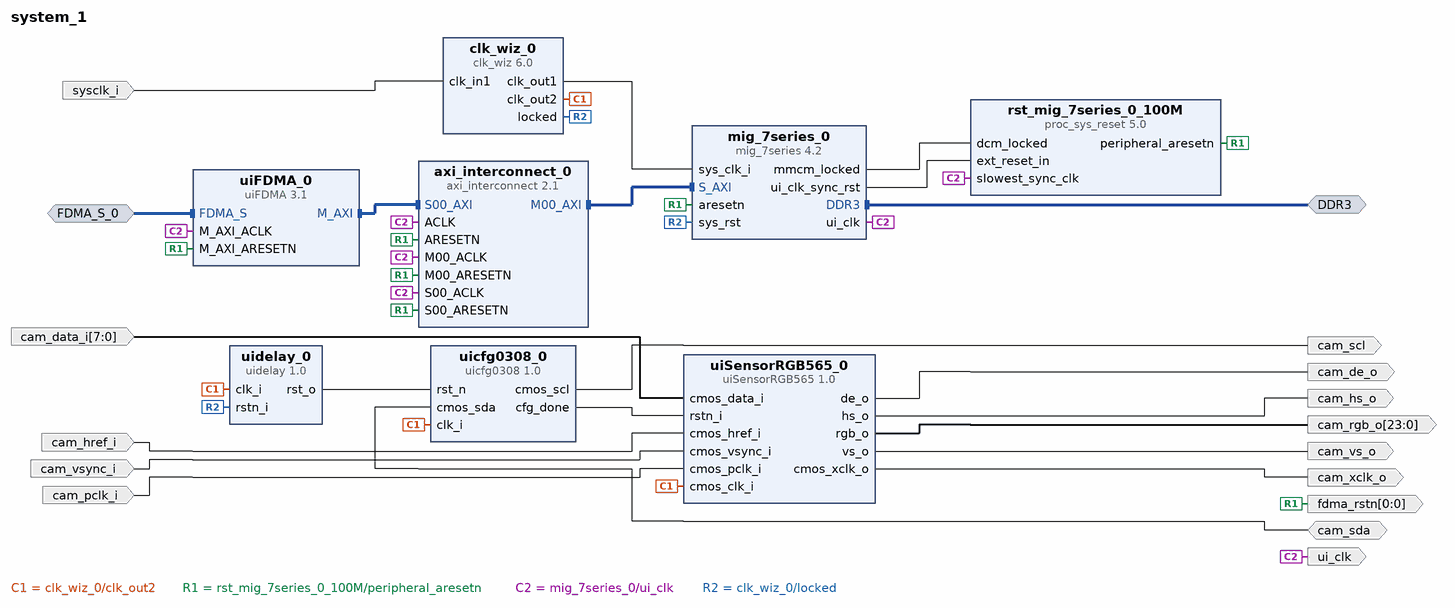
[diagram p0: block diagram of the top level]
# Vivado block design system_1, xc7a35tfgg484-2, Vivado 2019.2
create_bd_design system_1

create_bd_intf_port -mode Slave -vlnv xilinx.com:user:FDMA_rtl:1.0 FDMA_S_0
create_bd_intf_port -mode Master -vlnv xilinx.com:interface:ddrx_rtl:1.0 DDR3
create_bd_port -dir I -type clk sysclk_i
set_property -dict {CONFIG.FREQ_HZ 125000000} [get_bd_ports sysclk_i]
create_bd_port -dir O cam_scl
create_bd_port -dir IO cam_sda
create_bd_port -dir O cam_de_o
create_bd_port -dir O -type clk cam_xclk_o
create_bd_port -dir O cam_vs_o
create_bd_port -dir O cam_hs_o
create_bd_port -dir O -from 23 -to 0 cam_rgb_o
create_bd_port -dir I -from 7 -to 0 cam_data_i
create_bd_port -dir I cam_href_i
create_bd_port -dir I cam_vsync_i
create_bd_port -dir I -type clk cam_pclk_i
create_bd_port -dir O -from 0 -to 0 -type rst fdma_rstn
create_bd_port -dir O -type clk ui_clk

create_bd_cell -type ip -vlnv xilinx.com:ip:clk_wiz:6.0 clk_wiz_0
set_property -dict [list \
  CONFIG.CLKIN1_JITTER_PS 80.0 \
  CONFIG.CLKOUT1_JITTER 161.296 \
  CONFIG.CLKOUT1_PHASE_ERROR 222.305 \
  CONFIG.CLKOUT1_REQUESTED_OUT_FREQ 200.000 \
  CONFIG.CLKOUT2_JITTER 219.904 \
  CONFIG.CLKOUT2_PHASE_ERROR 222.305 \
  CONFIG.CLKOUT2_REQUESTED_OUT_FREQ 24.000 \
  CONFIG.CLKOUT2_USED true \
  CONFIG.MMCM_CLKFBOUT_MULT_F 48.000 \
  CONFIG.MMCM_CLKIN1_PERIOD 8.000 \
  CONFIG.MMCM_CLKOUT0_DIVIDE_F 6.000 \
  CONFIG.MMCM_CLKOUT1_DIVIDE 50 \
  CONFIG.MMCM_DIVCLK_DIVIDE 5 \
  CONFIG.NUM_OUT_CLKS 2 \
  CONFIG.PRIM_IN_FREQ 125.000 \
  CONFIG.USE_RESET false \
] [get_bd_cells clk_wiz_0]
create_bd_cell -type ip -vlnv xilinx.com:user:uidelay:1.0 uidelay_0
set_property -dict {CONFIG.DELAY_CLK_NUM 100000} [get_bd_cells uidelay_0]
create_bd_cell -type ip -vlnv xilinx.com:user:uicfg0308:1.0 uicfg0308_0
set_property -dict {CONFIG.CLK_DIV 199} [get_bd_cells uicfg0308_0]
create_bd_cell -type ip -vlnv xilinx.com:user:uiSensorRGB565:1.0 uiSensorRGB565_0
create_bd_cell -type ip -vlnv xilinx.com:user:uiFDMA:3.1 uiFDMA_0
set_property -dict {CONFIG.M_AXI_ID_WIDTH 1} [get_bd_cells uiFDMA_0]
create_bd_cell -type ip -vlnv xilinx.com:ip:proc_sys_reset:5.0 rst_mig_7series_0_100M
set_property -dict {CONFIG.C_AUX_RESET_HIGH 0} [get_bd_cells rst_mig_7series_0_100M]
create_bd_cell -type ip -vlnv xilinx.com:ip:mig_7series:4.2 mig_7series_0
set_property -dict [list \
  CONFIG.BOARD_MIG_PARAM Custom \
  CONFIG.RESET_BOARD_INTERFACE Custom \
  CONFIG.XML_INPUT_FILE mig_b.prj \
] [get_bd_cells mig_7series_0]
create_bd_cell -type ip -vlnv xilinx.com:ip:axi_interconnect:2.1 axi_interconnect_0
set_property -dict {CONFIG.NUM_MI 1 CONFIG.S00_HAS_DATA_FIFO 2 CONFIG.S00_HAS_REGSLICE 1} [get_bd_cells axi_interconnect_0]

# ---- connections ----

connect_bd_intf_net -intf_net FDMA_S_0_1 [get_bd_intf_ports FDMA_S_0] [get_bd_intf_pins uiFDMA_0/FDMA_S]
connect_bd_intf_net [get_bd_intf_pins axi_interconnect_0/M00_AXI] [get_bd_intf_pins mig_7series_0/S_AXI]
connect_bd_intf_net [get_bd_intf_ports DDR3] [get_bd_intf_pins mig_7series_0/DDR3]
connect_bd_intf_net [get_bd_intf_pins uiFDMA_0/M_AXI] [get_bd_intf_pins axi_interconnect_0/S00_AXI]
connect_bd_net -net clk_in1_0_1 [get_bd_ports sysclk_i] [get_bd_pins clk_wiz_0/clk_in1]
connect_bd_net [get_bd_pins uicfg0308_0/cmos_scl] [get_bd_ports cam_scl]
connect_bd_net [get_bd_ports cam_sda] [get_bd_pins uicfg0308_0/cmos_sda]
connect_bd_net [get_bd_pins uiSensorRGB565_0/de_o] [get_bd_ports cam_de_o]
connect_bd_net [get_bd_pins uiSensorRGB565_0/cmos_xclk_o] [get_bd_ports cam_xclk_o]
connect_bd_net [get_bd_pins uiSensorRGB565_0/vs_o] [get_bd_ports cam_vs_o]
connect_bd_net [get_bd_pins uiSensorRGB565_0/hs_o] [get_bd_ports cam_hs_o]
connect_bd_net [get_bd_pins uiSensorRGB565_0/rgb_o] [get_bd_ports cam_rgb_o]
connect_bd_net [get_bd_pins uicfg0308_0/cfg_done] [get_bd_pins uiSensorRGB565_0/rstn_i]
connect_bd_net -net cmos_data_i_0_1 [get_bd_ports cam_data_i] [get_bd_pins uiSensorRGB565_0/cmos_data_i]
connect_bd_net -net cmos_href_i_0_1 [get_bd_ports cam_href_i] [get_bd_pins uiSensorRGB565_0/cmos_href_i]
connect_bd_net -net cmos_vsync_i_0_1 [get_bd_ports cam_vsync_i] [get_bd_pins uiSensorRGB565_0/cmos_vsync_i]
connect_bd_net -net cmos_pclk_i_1_1 [get_bd_ports cam_pclk_i] [get_bd_pins uiSensorRGB565_0/cmos_pclk_i]
connect_bd_net [get_bd_pins uidelay_0/rst_o] [get_bd_pins uicfg0308_0/rst_n]
connect_bd_net [get_bd_pins clk_wiz_0/clk_out2] \
  [get_bd_pins uicfg0308_0/clk_i] [get_bd_pins uiSensorRGB565_0/cmos_clk_i] [get_bd_pins uidelay_0/clk_i]
connect_bd_net [get_bd_pins rst_mig_7series_0_100M/peripheral_aresetn] \
  [get_bd_ports fdma_rstn] [get_bd_pins axi_interconnect_0/M00_ARESETN] [get_bd_pins axi_interconnect_0/S00_ARESETN] \
  [get_bd_pins axi_interconnect_0/ARESETN] [get_bd_pins uiFDMA_0/M_AXI_ARESETN] [get_bd_pins mig_7series_0/aresetn]
connect_bd_net [get_bd_pins mig_7series_0/ui_clk] \
  [get_bd_ports ui_clk] [get_bd_pins uiFDMA_0/M_AXI_ACLK] [get_bd_pins axi_interconnect_0/M00_ACLK] \
  [get_bd_pins axi_interconnect_0/S00_ACLK] [get_bd_pins axi_interconnect_0/ACLK] \
  [get_bd_pins rst_mig_7series_0_100M/slowest_sync_clk]
connect_bd_net [get_bd_pins mig_7series_0/mmcm_locked] [get_bd_pins rst_mig_7series_0_100M/dcm_locked]
connect_bd_net [get_bd_pins mig_7series_0/ui_clk_sync_rst] [get_bd_pins rst_mig_7series_0_100M/ext_reset_in]
connect_bd_net [get_bd_pins clk_wiz_0/locked] [get_bd_pins mig_7series_0/sys_rst] [get_bd_pins uidelay_0/rstn_i]
connect_bd_net [get_bd_pins clk_wiz_0/clk_out1] [get_bd_pins mig_7series_0/sys_clk_i]

# ---- address map ----
assign_bd_address -offset 0x00000000 -range 256M -target_address_space [get_bd_addr_spaces uiFDMA_0/M_AXI] [get_bd_addr_segs mig_7series_0/memmap/memaddr]

validate_bd_design
save_bd_design
